# EAGLE schematic AugmentedStethoscope_vFinal (EAGLE 8.7.0)
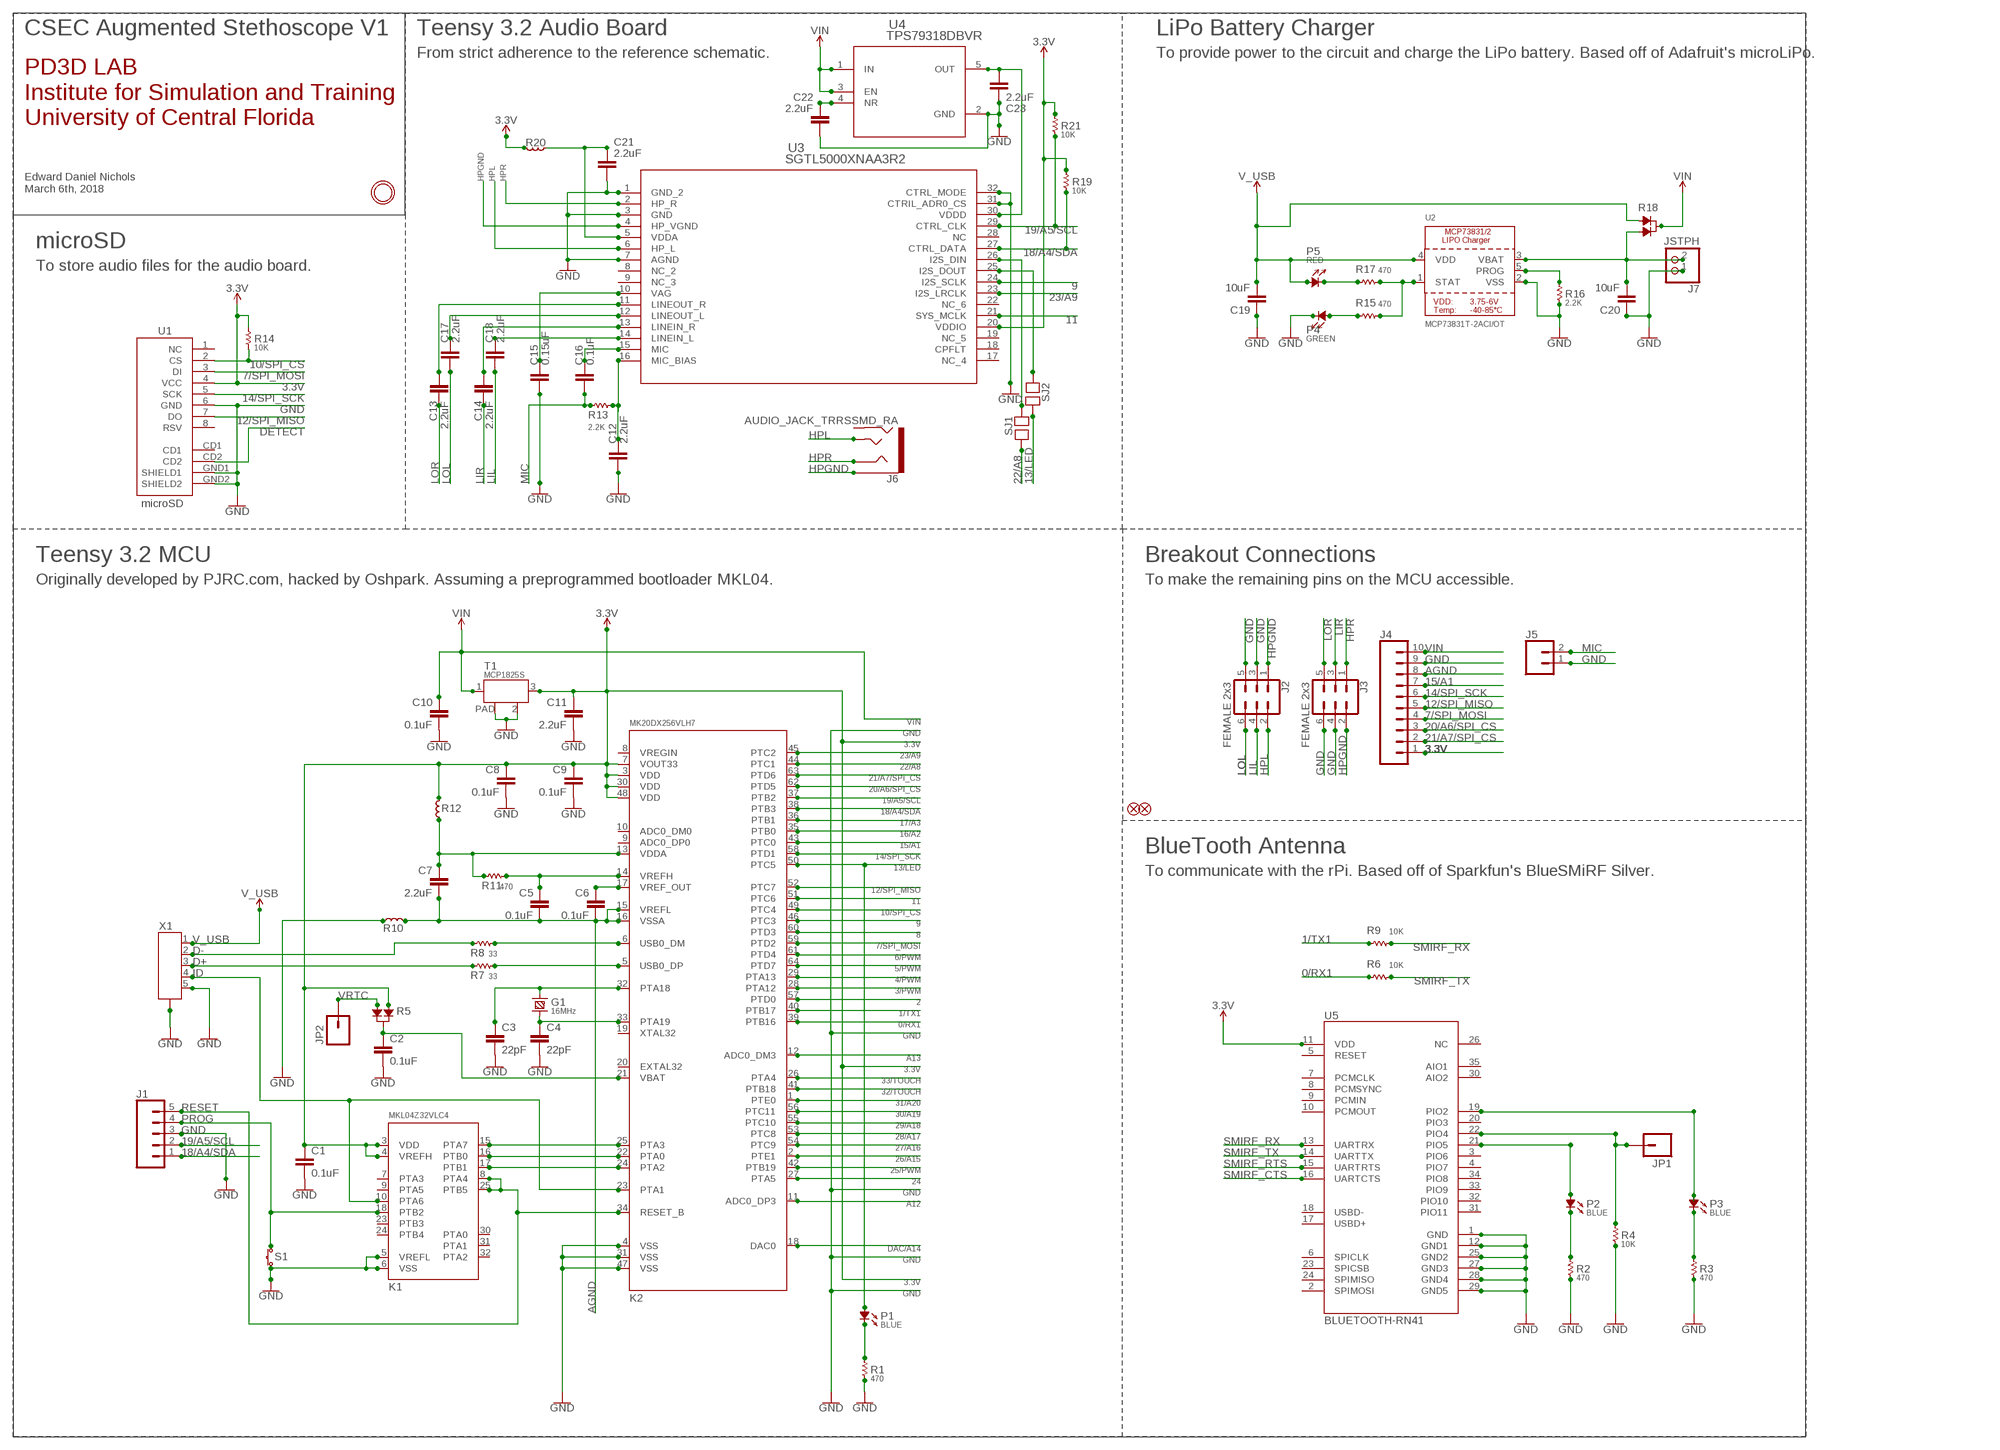
[diagram p0: schematic, sheet 1]

## Parts
C1  0.1uF  0.1UF-0603-25V-5%  [0603]
C2  0.1uF  0.1UF-0603-25V-5%  [0603]
C3  22pF  22PF-0603-50V-5%  [0603]
C4  22pF  22PF-0603-50V-5%  [0603]
C5  0.1uF  0.1UF-0603-25V-5%  [0603]
C6  0.1uF  0.1UF-0603-25V-5%  [0603]
C7  2.2uF  2.2UF-0603-10V-20%  [0603]
C8  0.1uF  0.1UF-0603-25V-5%  [0603]
C9  0.1uF  0.1UF-0603-25V-5%  [0603]
C10  0.1uF  0.1UF-0603-25V-5%  [0603]
C11  2.2uF  2.2UF-0603-10V-20%  [0603]
C12  2.2uF  2.2UF-0603-10V-20%  [0603]
C13  2.2uF  2.2UF-0603-10V-20%  [0603]
C14  2.2uF  2.2UF-0603-10V-20%  [0603]
C15  0.15uF  0.1UF-0603-25V-5%  [0603]
C16  0.1uF  0.1UF-0603-25V-5%  [0603]
C17  2.2uF  2.2UF-0603-10V-20%  [0603]
C18  2.2uF  2.2UF-0603-10V-20%  [0603]
C19  10uF  10UF-0805-10V-10%  [0805]
C20  10uF  10UF-0805-10V-10%  [0805]
C21  2.2uF  2.2UF-0603-10V-20%  [0603]
C22  2.2uF  2.2UF-0603-10V-20%  [0603]
C23  2.2uF  2.2UF-0603-10V-20%  [0603]
FID1  FIDUCIAL""  [FIDUCIAL_1MM]
FID2  FIDUCIAL""  [FIDUCIAL_1MM]
G1  16MHz  CRYSTAL-HC49US  [HC49US]
J1  CONN_05  [1X05]
J2  FEMALE 2x3  CONN_03X2FEMALE  [2X3]
J3  FEMALE 2x3  CONN_03X2FEMALE  [2X3]
J4  CONN_10"  [1X10]
J5  CONN_02  [1X02]
J6  AUDIO_JACK_TRRSSMD_RA  [AUDIO_JACK_3.5MM_TRRS_SMD_RA]
J7  JSTPH  JST_2PIN  [JSTPH2]
JP1  M01SMDNS  [1X01NS]
JP2  M01SMDNS  [1X01NS]
K1  MKL04Z32VLC4  [LQFP32-08]
K2  MK20DX256VLH7  [LQFP64-05]
P1  BLUE  LED  [LED-0805]
P2  BLUE  LED  [LED-0805]
P3  BLUE  LED  [LED-0805]
P4  GREEN  LED  [LED-0805]
P5  RED  LED  [LED-0805]
R1  470  RESISTOR-470R  [R0603]
R2  470  RESISTOR-470R  [R0603]
R3  470  RESISTOR-470R  [R0603]
R4  10K  RESISTOR-470R  [R0603]
R5  DIODE_DUAL  [SOT-23]
R6  10K  RESISTOR-33R  [R0603]
R7  33  RESISTOR-33R  [R0603]
R8  33  RESISTOR-33R  [R0603]
R9  10K  RESISTOR-33R  [R0603]
R10  FERRITE  [L0603]
R11  470  RESISTOR-470R  [R0603]
R12  FERRITE  [L0603]
R13  2.2K  RESISTOR-470R  [R0603]
R14  10K  RESISTOR-470R  [R0603]
R15  470  RESISTOR-33R  [R0603]
R16  2.2K  RESISTOR-470R  [R0603]
R17  470  RESISTOR-33R  [R0603]
R18  DIODE_DUAL  [SOT-23]
R19  10K  RESISTOR-470R  [R0603]
R20  FERRITE  [L0603]
R21  10K  RESISTOR-470R  [R0603]
S1  TACT_SWITCH  [ALPS_SKHH]
SJ1  SOLDERJUMPER  [SOLDERJUMPER]
SJ2  SOLDERJUMPER  [SOLDERJUMPER]
T1  MCP1825S  LDO  [SOT-223]
U1  microSD  USD-SOCKETSMD  [MICRO-SD-SOCKET-PP]
U2  MCP73831T-2ACI/OT  MCP73831/2  [SOT23-5]
U3  SGTL5000XNAA3R2  [QFN32]
U4  TPS79318DBVR  [DBV5]
U5  BLUETOOTH-RN41  BLUETOOTH-RN41"  [RN41]
U$1  MOUNTINGHOLE2.5  [MOUNTINGHOLE_2.5_PLATED]
X1  MINI-USB  MINI-USBMOLEX_0675031230  [MOLEX_SD-67503-010]

## Nets
0/RX1: K2.39(PTB16) R6.1
1/TX1: K2.40(PTB17) R9.1
2: K2.57(PTD0)
3.3V [power]: C1.1 C8.1 C9.1 C11.1 J4.1 K1.3(VDD) K1.4(VREFH) K2.3(VDD) K2.7(VOUT33) K2.30(VDD) K2.48(VDD) R5.1 R12.2 R14.2 R19.2 R20.2 R21.2 T1.3(OUT) U1.4(VCC) U3.20(VDDIO) U5.11(VDD)
3/PWM: K2.28(PTA12)
4/PWM: K2.29(PTA13)
5/PWM: K2.64(PTD7)
6/PWM: K2.61(PTD4)
7/SPI_MOSI: J4.4 K2.59(PTD2) U1.3(DI)
8: K2.60(PTD3)
9: K2.46(PTC3) U3.24(I2S_SCLK)
10/SPI_CS: K2.49(PTC4) R14.1 U1.2(CS)
11: K2.51(PTC6) U3.21(SYS_MCLK)
12/SPI_MISO: J4.5 K2.52(PTC7) U1.7(DO)
13/LED: K2.50(PTC5) P1.+ SJ2.2
14/SPI_SCK: J4.6 K2.58(PTD1) U1.5(SCK)
15/A1: J4.7 K2.43(PTC0)
16/A2: K2.35(PTB0)
17/A3: K2.36(PTB1)
18/A4/SDA: J1.1 K2.38(PTB3) R19.1 U3.27(CTRL_DATA)
19/A5/SCL: J1.2 K2.37(PTB2) R21.1 U3.29(CTRL_CLK)
20/A6/SPI_CS: J4.3 K2.62(PTD5)
21/A7/SPI_CS: J4.2 K2.63(PTD6)
22/A8: K2.44(PTC1) SJ1.2
23/A9: K2.45(PTC2) U3.23(I2S_LRCLK)
24: K2.27(PTA5)
25/PWM: K2.42(PTB19)
26/A15: K2.2(PTE1)
27/A16: K2.54(PTC9)
28/A17: K2.53(PTC8)
29/A18: K2.55(PTC10)
30/A19: K2.56(PTC11)
31/A20: K2.1(PTE0)
32/TOUCH: K2.41(PTB18)
33/TOUCH: K2.26(PTA4)
A12: K2.11(ADC0_DP3)
A13: K2.12(ADC0_DM3)
AGND: C5.2 C6.2 C7.2 J4.8 K2.15(VREFL) K2.16(VSSA) R10.2
D3: P2.- R2.2
D4: P3.- R3.2
D+: R7.1 X1.3
D-: R8.1 X1.2
DAC/A14: K2.18(DAC0)
DETECT: U1.CD2
GND [power]: C1.2 C2.2 C3.2 C4.2 C8.2 C9.2 C10.2 C11.2 C12.2 C15.1 C19.1 C20.1 C21.2 C22.2 C23.1 J1.3 J2.3 J2.5 J3.4 J3.6 J4.9 J5.1 J7.1 K1.5(VREFL) K1.6(VSS) K2.4(VSS) K2.31(VSS) K2.47(VSS) P4.- R1.1 R2.1 R3.1 R4.1 R10.1 R16.1 S1.3 S1.4 T1.2(GND) T1.PAD U1.6(GND) U1.GND1(SHIELD1) U1.GND2(SHIELD2) U2.2(VSS) U3.1(GND_2) U3.3(GND) U3.7(AGND) U3.31(CTRIL_ADR0_CS) U3.32(CTRL_MODE) U4.2(GND) U5.1(GND) U5.12(GND1) U5.25(GND2) U5.27(GND3) U5.28(GND4) U5.29(GND5) X1.5 X1.P$1(CASE) X1.P$2(CASE) X1.P$3(CASE) X1.P$4(CASE) X1.P$5(CASE) X1.P$6(CASE)
HPGND: J2.1 J3.2 J6.EARTH U3.4(HP_VGND)
HPL: J2.2 J6.TIP U3.6(HP_L)
HPR: J3.1 J6.RING1 U3.2(HP_R)
ID: K1.10(PTA6) K2.23(PTA1) X1.4
LIL: C18.2 J2.4
LIL_ISO: C18.1 U3.14(LINEIN_L)
LIR: C14.2 J3.3
LIR_ISO: C14.1 U3.13(LINEIN_R)
LOL: C17.2 J2.6
LOL_ISO: C17.1 U3.12(LINEOUT_L)
LOR: C13.2 J3.5
LOR_ISO: C13.1 U3.11(LINEOUT_R)
MIC: C16.1 J5.2 R13.1
MIC_BIAS: C12.1 R13.2 U3.16(MIC_BIAS)
N$1: C20.2 J7.2 R18.2 U2.3(VBAT)
N$2: K1.16(PTB0) K2.22(PTA0)
N$3: K1.17(PTB1) K2.24(PTA2)
N$4: C15.2 U3.10(VAG)
N$5: C3.1 G1.1 K2.32(PTA18)
N$6: C4.1 G1.2 K2.33(PTA19)
N$7: C5.1 K2.14(VREFH) R11.2
N$8: C22.1 U4.4(NR)
N$9: SJ1.1 U3.26(I2S_DIN)
N$10: K2.5(USB0_DP) R7.2
N$11: C6.1 K2.17(VREF_OUT)
N$12: C23.2 U3.30(VDDD) U4.5(OUT)
N$13: SJ2.1 U3.25(I2S_DOUT)
N$14: K2.6(USB0_DM) R8.2
N$15: C16.2 U3.15(MIC)
N$16: P3.+ U5.19(PIO2)
N$17: C7.1 K2.13(VDDA) R11.1 R12.1
N$52: P1.- R1.2
N$68: C2.1 K2.21(VBAT) R5.3
N$70: K1.15(PTA7) K2.25(PTA3)
N$71: P5.- R17.1
N$72: R15.2 R17.2 U2.1(STAT)
N$73: P2.+ U5.21(PIO5)
N$75: R16.2 U2.5(PROG)
N$76: P4.+ R15.1
N$79: C21.1 R20.1 U3.5(VDDA)
PIO4: JP1.1 R4.2 U5.22(PIO4)
PROG: J1.4 K1.18(PTB2) S1.1 S1.2
RESET: J1.5 K1.8(PTA4) K1.25(PTB5) K2.34(RESET_B)
SMIRF_CTS: U5.16(UARTCTS)
SMIRF_RTS: U5.15(UARTRTS)
SMIRF_RX: R9.2 U5.13(UARTRX)
SMIRF_TX: R6.2 U5.14(UARTTX)
V_USB [power]: C19.2 P5.+ R18.1 U2.4(VDD) X1.1
VIN [power]: C10.1 J4.10 R18.3 T1.1(IN) U4.1(IN) U4.3(EN)
VRTC: JP2.1 R5.2
Unconnected: J6.RING2 K1.7(PTA3) K1.9(PTA5) K1.23(PTB3) K1.24(PTB4) K1.30(PTA0) K1.31(PTA1) K1.32(PTA2) K2.8(VREGIN) K2.9(ADC0_DP0) K2.10(ADC0_DM0) K2.19(XTAL32) K2.20(EXTAL32) U1.1(NC) U1.8(RSV) U1.CD1 U3.8(NC_2) U3.9(NC_3) U3.17(NC_4) U3.18(CPFLT) U3.19(NC_5) U3.22(NC_6) U3.28(NC) U5.2(SPIMOSI) U5.3(PIO6) U5.4(PIO7) U5.5(RESET) U5.6(SPICLK) U5.7(PCMCLK) U5.8(PCMSYNC) U5.9(PCMIN) U5.10(PCMOUT) U5.17(USBD+) U5.18(USBD-) U5.20(PIO3) U5.23(SPICSB) U5.24(SPIMISO) U5.26(NC) U5.30(AIO2) U5.31(PIO11) U5.32(PIO10) U5.33(PIO9) U5.34(PIO8) U5.35(AIO1)

## Notes on the sheet
- CSEC Augmented Stethoscope V1 | Teensy 3.2 Audio Board | LiPo Battery Charger
- From strict adherence to the reference schematic. | To provide power to the circuit and charge the LiPo battery. Based off of Adafruit's microLiPo.
- PD3D LAB
  Institute for Simulation and Training
  University of Central Florida
- Edward Daniel Nichols
  March 6th, 2018
- microSD
- To store audio files for the audio board.
- Teensy 3.2 MCU | Breakout Connections
- Originally developed by PJRC.com, hacked by Oshpark. Assuming a preprogrammed bootloader MKL04. | To make the remaining pins on the MCU accessible.
- BlueTooth Antenna
- To communicate with the rPi. Based off of Sparkfun's BlueSMiRF Silver.

## Library data of the parts
C1 C2 C5 C6 C8-C10 C16 = SparkFun-Capacitors:0.1UF: 0.1µF ceramic capacitors A capacitor is a passive two-terminal electrical component used to store electrical energy temporarily in an electric field.; PROD_ID: CAP-08604
C3 C4 = SparkFun-Capacitors:22PF: 22pF ceramic capacitors A capacitor is a passive two-terminal electrical component used to store electrical energy temporarily in an electric field.; PROD_ID: CAP-07876
C7 C11-C14 C17 C18 C21-C23 = SparkFun-Capacitors:2.2UF: 2.2µF ceramic capacitors A capacitor is a passive two-terminal electrical component used to store electrical energy temporarily in an electric field.; PROD_ID: CAP-07888
C15 = SparkFun-Capacitors:0.1UF: 0.1µF ceramic capacitors A capacitor is a passive two-terminal electrical component used to store electrical energy temporarily in an electric field.; PROD_ID: CAP-08604; VALUE: 0.1uF
C19 C20 = SparkFun-Capacitors:10UF: 10.0µF ceramic capacitors A capacitor is a passive two-terminal electrical component used to store electrical energy temporarily in an electric field.; PROD_ID: CAP-11330
FID1 FID2 = microbuilder:FIDUCIAL: Fiducial Alignment Points Various fiducial points for machine vision alignment.; BOM: EXCLUDE
G1 = t32_ref:CRYSTAL-; DESC: 16MHz / 18pF / 10ppm; MF: ABRACON; MPN: ABL-16.000MHz-B1U; OC_MOUSER: 815-ABL-16-B1U; PACKAGE: HC-49US; TYPE: Crystal
J1 = SparkFun-Connectors:CONN_05: Multi connection point. Often used as Generic Header-pin footprint for 0.1 inch spaced/style header connections On any of the 0.1 inch spaced packages, you can populate with these: Break Away Headers - Straight <https://www.sparkfun.com/products/116> (PRT-00116) Break Away Male Headers - Right Angle <https://www.sparkfun.com/products/553> (PRT-00553) Female Headers <https://www.sparkfun.com/products/115> (PRT-00115) Break Away Headers - Machine Pin <https://www.sparkfun.com/products/117> (PRT-00117) Break Away Female Headers - Swiss Machine Pin <https://www.sparkfun.com/products/743> (PRT-00743) For SCREWTERMINALS and SPRING TERMINALS visit here: Screw Terimnals on SparkFun.com <https://www.sparkfun.com/search/results?term=Screw+Terminals> (5mm/3.5mm/2.54mm spacing) This device is also useful as a general connection point to wire up your design to another part of your project. Our various solder wires solder well into these plated through hole pads. Hook-Up Wire - Assortment (Stranded, 22 AWG) <https://www.sparkfun.com/products/11375> (PRT-11375) Hook-Up Wire - Assortment (Solid Core, 22 AWG) <https://www.sparkfun.com/products/11367> (PRT-11367) View the entire wire category on our website here <https://www.sparkfun.com/categories/141> Special notes: Molex polarized connector foot print use with SKU : PRT-08231 with associated crimp pins and housings. 1MM SMD Version SKU: PRT-10208
J2 J3 = SparkFun-Connectors:CONN_03X2: Multi connection point. Often used as Generic Header-pin footprint for 0.1 inch spaced/style header connections You can populate with any combo of single row headers, but if you'd like an exact match, check these: Header - 2x3 (Male, 0.1") <https://www.sparkfun.com/products/12807> (PRT-12807) Header - 2x3 (Female, 0.1") <https://www.sparkfun.com/products/13010> (PRT-13010) 2x3 Pin Shrouded Header <https://www.sparkfun.com/products/10877> (PRT-10877) On any of the 0.1 inch spaced packages, you can populate with these: Break Away Headers - Straight <https://www.sparkfun.com/products/116> (PRT-00116) Break Away Male Headers - Right Angle <https://www.sparkfun.com/products/553> (PRT-00553) Female Headers <https://www.sparkfun.com/products/115> (PRT-00115) Break Away Headers - Machine Pin <https://www.sparkfun.com/products/117> (PRT-00117) Break Away Female Headers - Swiss Machine Pin <https://www.sparkfun.com/products/743> (PRT-00743) Special note: the shrouded connector mates well with our 3x2 ribbon cables: Ribbon Crimp Connector - 6-pin (2x3, Female) <https://www.sparkfun.com/products/10651> (PRT-10651) Ribbon Cable - 6 wire (15ft) <https://www.sparkfun.com/products/10646> (PRT-10646); PROD_ID: CONN-11566
J4 = SparkFun-Connectors:CONN_10: Multi connection point. Often used as Generic Header-pin footprint for 0.1 inch spaced/style header connections On any of the 0.1 inch spaced packages, you can populate with these: Break Away Headers - Straight <https://www.sparkfun.com/products/116> (PRT-00116) Break Away Male Headers - Right Angle <https://www.sparkfun.com/products/553> (PRT-00553) Female Headers <https://www.sparkfun.com/products/115> (PRT-00115) Break Away Headers - Machine Pin <https://www.sparkfun.com/products/117> (PRT-00117) Break Away Female Headers - Swiss Machine Pin <https://www.sparkfun.com/products/743> (PRT-00743) Arduino Stackable Header - 10 Pin <https://www.sparkfun.com/products/11376> (PRT-11376) For SCREWTERMINALS and SPRING TERMINALS visit here: Screw Terimnals on SparkFun.com <https://www.sparkfun.com/search/results?term=Screw+Terminals> (5mm/3.5mm/2.54mm spacing) This device is also useful as a general connection point to wire up your design to another part of your project. Our various solder wires solder well into these plated through hole pads. Hook-Up Wire - Assortment (Stranded, 22 AWG) <https://www.sparkfun.com/products/11375> (PRT-11375) Hook-Up Wire - Assortment (Solid Core, 22 AWG) <https://www.sparkfun.com/products/11367> (PRT-11367) View the entire wire category on our website here <https://www.sparkfun.com/categories/141> Special notes: Molex polarized connector foot print use with SKU : PRT-08231 with associated crimp pins and housings. 1MM SMD Version SKU: PRT-10208 NOTES ON THE VARIANTS LOCK and LOCK_LONGPADS... This footprint was designed to help hold the alignment of a through-hole component (i.e. 6-pin header) while soldering it into place. You may notice that each hole has been shifted either up or down by 0.005 of an inch from it's more standard position (which is a perfectly straight line). This slight alteration caused the pins (the squares in the middle) to touch the edges of the holes. Because they are alternating, it causes a "brace" to hold the component in place. 0.005 has proven to be the perfect amount of "off-center" position when using our standard breakaway headers. Although looks a little odd when you look at the bare footprint, once you have a header in there, the alteration is very hard to notice. Also,if you push a header all the way into place, it is covered up entirely on the bottom side.; PROD_ID: CONN-11563
J5 = SparkFun-Connectors:CONN_02: Multi connection point. Often used as Generic Header-pin footprint for 0.1 inch spaced/style header connections On any of the 0.1 inch spaced packages, you can populate with these: Break Away Headers - Straight <https://www.sparkfun.com/products/116> (PRT-00116) Break Away Male Headers - Right Angle <https://www.sparkfun.com/products/553> (PRT-00553) Female Headers <https://www.sparkfun.com/products/115> (PRT-00115) Break Away Headers - Machine Pin <https://www.sparkfun.com/products/117> (PRT-00117) Break Away Female Headers - Swiss Machine Pin <https://www.sparkfun.com/products/743> (PRT-00743) For SCREWTERMINALS and SPRING TERMINALS visit here: Screw Terimnals on SparkFun.com <https://www.sparkfun.com/search/results?term=Screw+Terminals> (5mm/3.5mm/2.54mm spacing) This device is also useful as a general connection point to wire up your design to another part of your project. Our various solder wires solder well into these plated through hole pads. Hook-Up Wire - Assortment (Stranded, 22 AWG) <https://www.sparkfun.com/products/11375> (PRT-11375) Hook-Up Wire - Assortment (Solid Core, 22 AWG) <https://www.sparkfun.com/products/11367> (PRT-11367) View the entire wire category on our website here <https://www.sparkfun.com/categories/141> Special notes: Molex polarized connector foot print use with: PRT-08233 with associated crimp pins and housings. 2.54_SCREWTERM for use with PRT-10571. 3.5mm Screw Terminal footprints for PRT-08084 5mm Screw Terminal footprints for use with PRT-08432
J6 = SparkFun-Connectors:AUDIO_JACK_TRRS: Audio Jack - 3.5mm TRRS (SMD) This is a 3.5mm TRRS SMD audio jack. TRRS connectors are the audio-style connectors that you see on some phones, MP3 players and development boards. TRRS stands for “tip, ring, ring, sleeve,” which reflects that this has three conductors and a ground. SparkFun Products: Audio Jack <https://www.sparkfun.com/products/12639> mbed Starter Kit <https://www.sparkfun.com/products/12968> SparkFun TRRS 3.5mm Jack Breakout <https://www.sparkfun.com/products/11570>; PROD_ID: CONN-10676; SF_ID: PRT-12639
J7 = microbuilder:JST_2PIN: JST 2-Pin Right-Angle Connector PH-Series - 4UConnector: 17311 SH-Series - 4UConnector: 07278
JP1 JP2 = SparkFun:M01: Header 1 Standard 1-pin 0.1" header. Use with straight break away headers (SKU : PRT-00116), right angle break away headers (PRT-00553), swiss pins (PRT-00743), machine pins (PRT-00117), and female headers (PRT-00115).
K1 = t32_ref:MKL04Z32VLC4; DESC: MKL04Z32VLC4 (preprogrammed); MF: PJRC; MPN: IC_MKL04Z32_TQFP32; PACKAGE: LQFP-32; TYPE: Microcontroller
K2 = t32_ref:MK20DX256VLH7; DESC: MK20DX256VLH7; MF: NXP; MPN: MK20DX256VLH7; OC_MOUSER: 841-MK20DX256VLH7; PACKAGE: LQFP-64; TYPE: Microcontroller
P1-P5 = t32_ref:LED; DESC: orange; MF: ROHM Semiconductor; MPN: SML-211DTT86; OC_MOUSER: 755-SML-211DTT86; PACKAGE: 0805; TYPE: LED
R1-R4 R11 R13 R14 R16 R19 R21 = t32_ref:RESISTOR-470R; DESC: 470R / 1 % / 0.1 W; MF: Vishay; MPN: CRCW0603470RFKEA; OC_MOUSER: 71-CRCW0603-470-E3; PACKAGE: 0603; TYPE: Resistor; VALUE: 470R
R5 R18 = t32_ref:DIODE_DUAL; DESC: Dual Schottky, common cat; MF: NXP Semiconductors; MPN: BAT54C,215; OC_MOUSER: 771-BAT54C-T/R; PACKAGE: SOT-23; TYPE: Diode
R6-R9 R15 R17 = t32_ref:RESISTOR-33R; DESC: 33R / 1% / 0.25 W; MF: Panasonic; MPN: ERJ-PA3F33R0V; OC_MOUSER: 667-ERJ-PA3F33R0V; PACKAGE: 0603; TYPE: Resistor; VALUE: 33R
R10 R12 R20 = t32_ref:FERRITE; DESC: 600R / 100MHz; MF: Murata Electronics; MPN: BLM18AG601SN1D; OC_MOUSER: 81-BLM11A601S; PACKAGE: 0603; TYPE: Ferrite
S1 = t32_ref:TACT_SWITCH; DESC: SPST; MF: ALPS; MPN: SKHHPKA010; OC_MOUSER: 688-SKHHPK; PACKAGE: 6x6x5 MM; TYPE: Tactile switch
SJ1 SJ2 = t32_ref:SOLDERJUMPER
T1 = t32_ref:LDO; DESC: 3.3V 500mA; MF: Microchip Technology; MPN: MCP1825S-3302E/DB; OC_MOUSER: 579-MCP1825S-3302EDB; PACKAGE: SOT-223-3; TYPE: Voltage regulator
U1 = SparkFun:USD-SOCKET: microSD Socket Push-push type uSD socket. Schematic element and footprint production proven. Spark Fun Electronics SKU : PRT-00127. tDoc lines correctly indicate media card edge positions when inserting (unlocked, locked, depressed).
U2 = microbuilder:MCP73831/2: MCP73831/2 LIPO Charger VDD: 3.75 - 6V Temp -40 - 85°C Programmable Charge Rate: 15-500mA NOTE: STAT is a tri-state logic output on the MCP73831 and an open-drain output on the MCP73832. SOT23-5 with 4.2V output and tri-state logic on STAT = MCP73831T-2ACI/OT
U3 = pd3d_augmentedstethoscope:SGTL5000XNAA3R2: SGTL5000XNAA3R2TR-ND Low Power Stereo Codec with Headphone Amp used on the Teensy 3.1+ Audio Board Datasheet: https://www.nxp.com/docs/en/data-sheet/SGTL5000.pdf (valid as of Feb. 2018) Exported from digikey.ultralibrarian.com under part ID: SGTL5000XNAA3R2TR-ND EDN; MANUFACTURER_PART_NUMBER: SGTL5000XNAA3R2; VENDOR: Freescale
U4 = pd3d_augmentedstethoscope:TPS79318DBVR: TPS79318DBVR Low-Noise, High PSRR, RF, 200-mA Low-Dropout Linear Regulators in NanoStar™ Wafer Chip Scale and SOT-23; MANUFACTURER_PART_NUMBER: TPS79318DBVR; VENDOR: Texas Instruments
U5 = ScratchPad:BLUETOOTH-RN41
U$1 = microbuilder:MOUNTINGHOLE: Mounting Hole For #2 screws (0.086"/2.18mm width, 0.094"/2.4mm hole) use 2.5mm; BOM: EXCLUDE
X1 = t32_ref:MINI-USB; DESC: MINI USB; MF: MOLEX; MPN: 0675031020; OC_MOUSER: 538-67503-1020; TYPE: Mini USB

## Net classes
0 default: width 0.152 mm, drill 0.152 mm, clearance 0.152 mm
1 power: width 0.254 mm, drill 0.203 mm, clearance 0.203 mm